# Altium schematic sheet PIC.SchDoc
size A4
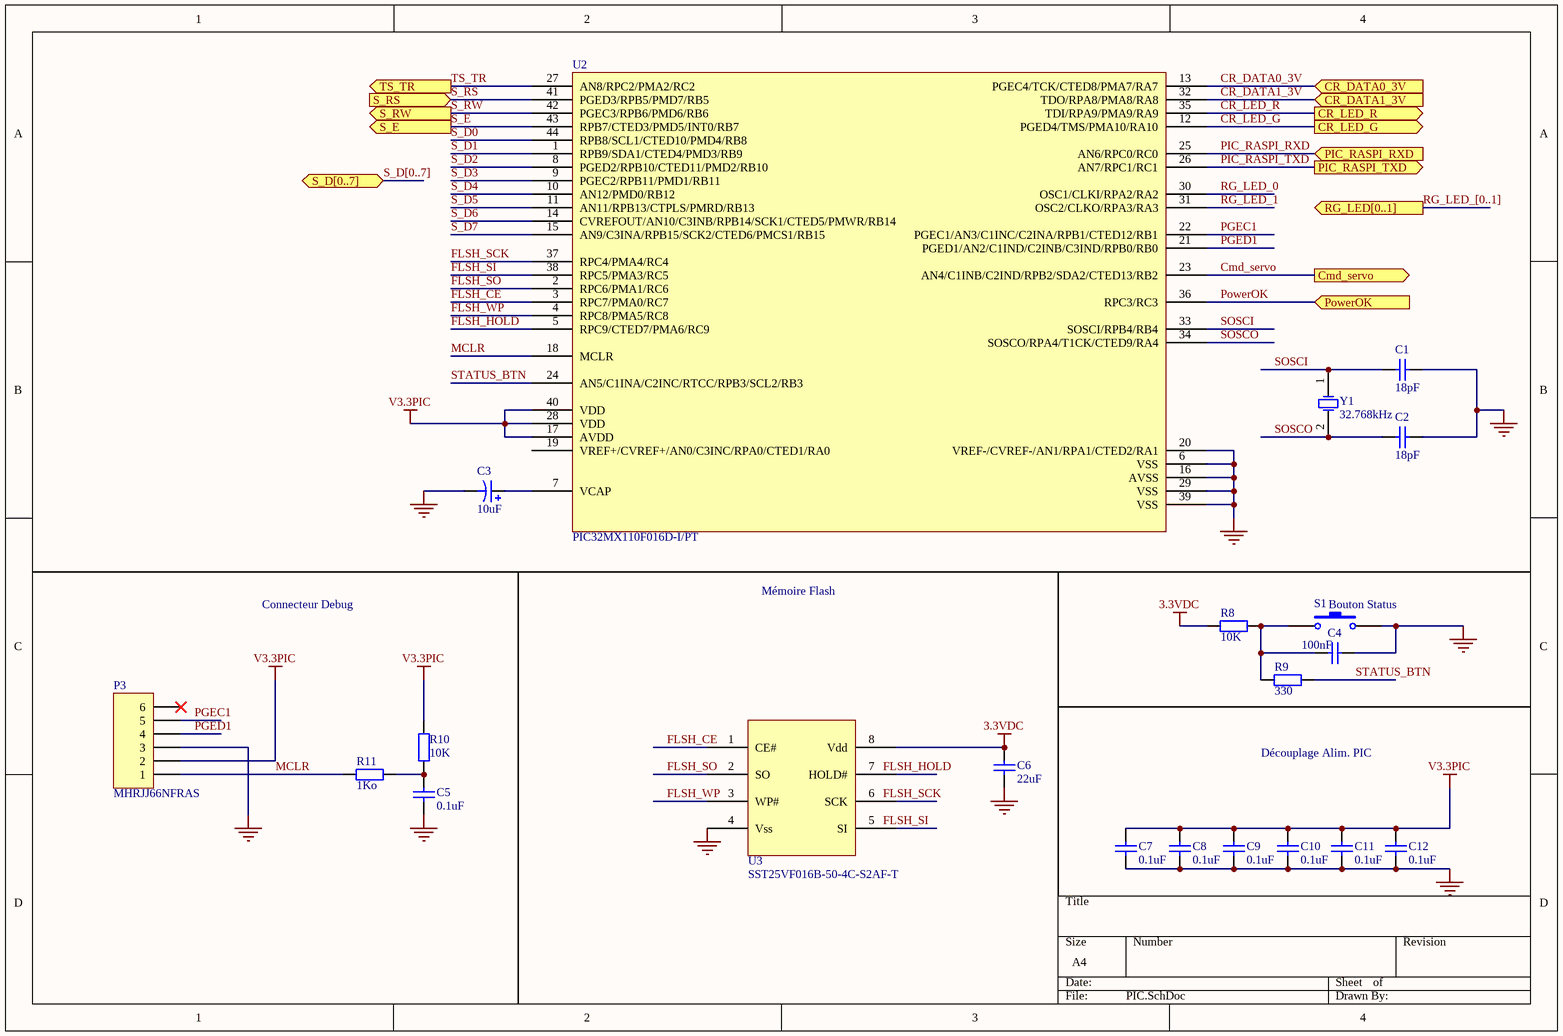
[diagram p0: PIC.SchDoc]

## Parts
C1  18pF  [RAD-0.3]
C2  18pF  [RAD-0.3]
C3  10uF  [RB7.6-15]
C4  100nF  [RAD-0.3]
C5  0.1uF  [RAD-0.3]
C6  22uF  [RAD-0.3]
C7  0.1uF  [RAD-0.3]
C8  0.1uF  [RAD-0.3]
C9  0.1uF  [RAD-0.3]
C10  0.1uF  [RAD-0.3]
C11  0.1uF  [RAD-0.3]
C12  0.1uF  [RAD-0.3]
P3  MHRJJ66NFRAS  [HDR1X6]
R8  10K  [AXIAL-0.4]
R9  330  [AXIAL-0.4]
R10  10K  [AXIAL-0.4]
R11  1Ko  [AXIAL-0.4]
S1  Bouton Status  [SPST-2]  (value not drawn)
U2  PIC32MX110F016D-I/PT
U3  SST25VF016B-50-4C-S2AF-T
Y1  32.768kHz  [R38]

## Ports
Cmd_servo (out), CR_DATA0_3V (in), CR_DATA1_3V (in), CR_LED_G (out), CR_LED_R (out), PIC_RASPI_RXD (in), PIC_RASPI_TXD (out), PowerOK (in), RG_LED[0..1] (out), S_D[0..7] (bidir), S_E (out), S_RS (in), S_RW (out), TS_TR (out)

## Nets
3.3VDC: C6.2 R8.1 U3.8(Vdd)
GND: C1.1 C2.1 C3.2 C4.2 C5.1 C6.1 C7.1 C8.1 C9.1 C10.1 C11.1 C12.1 P3.3 S1.2 U2.6(VSS) U2.16(AVSS) U2.20(VREF-/CVREF-/AN1/RPA1/CTED2/RA1) U2.29(VSS) U2.39(VSS) U3.4(Vss)
V3.3PIC: C7.2 C8.2 C9.2 C10.2 C11.2 C12.2 P3.2 R10.2 U2.17(AVDD) U2.28(VDD) U2.40(VDD)
Cmd_servo: U2.23(AN4/C1INB/C2IND/RPB2/SDA2/CTED13/RB2) ; port Cmd_servo
CR_DATA0_3V: U2.13(PGEC4/TCK/CTED8/PMA7/RA7) ; port CR_DATA0_3V
CR_DATA1_3V: U2.32(TDO/RPA8/PMA8/RA8) ; port CR_DATA1_3V
CR_LED_G: U2.12(PGED4/TMS/PMA10/RA10) ; port CR_LED_G
CR_LED_R: U2.35(TDI/RPA9/PMA9/RA9) ; port CR_LED_R
FLSH_CE: U2.3(RPC7/PMA0/RC7) U3.1(CE#)
FLSH_HOLD: U2.5(RPC9/CTED7/PMA6/RC9)
FLSH_SCK: U2.37(RPC4/PMA4/RC4)
FLSH_SI: U2.38(RPC5/PMA3/RC5)
FLSH_SO: U2.2(RPC6/PMA1/RC6) U3.2(SO)
FLSH_WP: U2.4(RPC8/PMA5/RC8) U3.3(WP#)
MCLR: P3.1 R11.2 U2.18(MCLR)
PGEC1: P3.5 U2.22(PGEC1/AN3/C1INC/C2INA/RPB1/CTED12/RB1)
PGED1: P3.4 U2.21(PGED1/AN2/C1IND/C2INB/C3IND/RPB0/RB0)
PIC_RASPI_RXD: U2.25(AN6/RPC0/RC0) ; port PIC_RASPI_RXD
PIC_RASPI_TXD: U2.26(AN7/RPC1/RC1) ; port PIC_RASPI_TXD
PowerOK: U2.36(RPC3/RC3) ; port PowerOK
RG_LED_0: U2.30(OSC1/CLKI/RPA2/RA2)
RG_LED_1: U2.31(OSC2/CLKO/RPA3/RA3)
S_D0: U2.44(RPB8/SCL1/CTED10/PMD4/RB8)
S_D1: U2.1(RPB9/SDA1/CTED4/PMD3/RB9)
S_D2: U2.8(PGED2/RPB10/CTED11/PMD2/RB10)
S_D3: U2.9(PGEC2/RPB11/PMD1/RB11)
S_D4: U2.10(AN12/PMD0/RB12)
S_D5: U2.11(AN11/RPB13/CTPLS/PMRD/RB13)
S_D6: U2.14(CVREFOUT/AN10/C3INB/RPB14/SCK1/CTED5/PMWR/RB14)
S_D7: U2.15(AN9/C3INA/RPB15/SCK2/CTED6/PMCS1/RB15)
S_E: U2.43(RPB7/CTED3/PMD5/INT0/RB7) ; port S_E
S_RS: U2.41(PGED3/RPB5/PMD7/RB5) ; port S_RS
S_RW: U2.42(PGEC3/RPB6/PMD6/RB6) ; port S_RW
SOSCI: C1.2 U2.33(SOSCI/RPB4/RB4) Y1.1(OSC1)
SOSCO: C2.2 U2.34(SOSCO/RPA4/T1CK/CTED9/RA4) Y1.2(OSC2)
STATUS_BTN: R9.2 U2.24(AN5/C1INA/C2INC/RTCC/RPB3/SCL2/RB3)
TS_TR: U2.27(AN8/RPC2/PMA2/RC2) ; port TS_TR
NetC3_1: C3.1 U2.7(VCAP)
NetC4_1: C4.1 R8.2 R9.1 S1.1
NetC5_2: C5.2 R10.1 R11.1

Not connected (* = marked no-connect by the designer): P3 6*; U2 19(VREF+/CVREF+/AN0/C3INC/RPA0/CTED1/RA0); U3 5(SI) 6(SCK) 7(HOLD#)

## Buses and harness runs
bus RG_LED_[0..1] = port RG_LED[0..1]
bus S_D[0..7] = port S_D[0..7]

## Notes on the sheet
- Connecteur Debug
- Mémoire Flash
- (near S1) Bouton Status
- Découplage Alim. PIC
- Labels drawn without touching a wire or pin: FLSH_HOLD, FLSH_SCK, FLSH_SI

## Library data of the parts
C1 C2 = Cap: Capacitor; Fournisseur: Farnell; Fabricant: AVX; Ref.Fabricant: 02013A180JAT2A; Ref.Fournisseur: 1740563
C3 = Cap Pol1: Fournisseur: Farnell; Ref.Fournisseur: 2353238; Ref.Fabricant: TL3C106K025C0450..; Fabricant: VISHAY
C4 = Cap: Capacitor; Fournisseur: Farnell; Ref.Fournisseur: 2812613; Fabricant: WURTH ELECTRONIK; Ref.Fabricant: 885342211005; Value: 100nF
C5 C7-C12 = Cap: Capacitor; Fournisseur: Farnell; Fabricant: Multicomp; Ref.Fabricant: MCY4C3B104M160CT; Ref.Fournisseur: 2310273; Value: 0.1uF
C6 = Cap: Cout_Reg_3.3v; Fournisseur: Farnell; Fabricant: AVX; Ref.Fabricant: 12103D226KAT2A; Ref.Fournisseur: 1833829; Value: 22uF
P3 = Header 6: PortRJ12_debug; Fournisseur: Farnell; Fabricant: MH Connectors; Ref.Fournisseur: 3938372; Ref.Fabricant: MHRJJ66NFRAS
R8 = Res2: Resistor; Fabricant: TE CONNECTIVITY; Fournisseur: Farnell; Ref.Fabricant: CPF0201D10KC1; Ref.Fournisseur: 2117887
R9 = Res2: Resistor; Fabricant: TE Connectivity; Fournisseur: Farnell; Ref.Fabricant: RN73C1J232RBTDF; Ref.Fournisseur: 2687973
R10 = Res2: Resistor; Fournisseur: Farnell; Fabricant: TE CONNECTIVITY; Ref.Fabricant: CPF0201D10KC1; Ref.Fournisseur: 2117887; Value: 10k
R11 = Res2: Resistor; Value: 1K; Fournisseur: Farnell; Fabricant: TE CONNECTIVITY; Ref.Fabricant: CPF0201D1K0E1; Ref.Fournisseur: 2117780
S1 = SW-PB: Switch; Fournisseur: Farnell; Fabricant: RAFI; Ref.Fabricant: 1.10.001.001/0205; Ref.Fournisseur: 9927360
U2 = PIC32: Fournisseur: Farnell; Fabricant: MICROCHIP; Ref.Fournisseur: 2057068; Ref.Fabricant: PIC32MX110F016D-I/PT
U3 = Memoire: FLASH; Fournisseur: Farnell; Fabricant: Microchip; Ref.Fournisseur: 2810109; Ref.Fabricant: SST25VF016B-50-4C-S2AF-T
Y1 = XTAL: Crystal Oscillator; Fournisseur: Farnell; Fabricant: ABRACON; Ref.Fabricant: ABS07-32.768KHZ-7-T; Ref.Fournisseur: 1838935